# Altium schematic sheet Gate_Driver.SchDoc
size A4; SheetNumber: 2; SheetTotal: 8; SPICEModelCacheSDNXEFHK: <root> / <DocumentId>SDNXEFHK</DocumentId> / <CacheFrame Number="0"> / <Model Name="jmk325ac6107_m-p" Kind="CKT"> / <Text>* JMK325AC6107_M-P     SPICE MODEL  ( General Type ) / *-------------------------------------------------------------------------------------------------------- / * Model Generated by TAIYO YUDEN Corporation (http://www.ty-top.com) / * Version 1.0 / * TAIYO YUDEN Control No. 180521 / *-------------------------------------------------------------------------------------------------------- / * / * Products Name : Multilayer Ceramic Capacitors / * / * Characteristics : / *     Capacitance : 100 uF , Rated Voltage : 6.3V , TCC : X6S / *     Case Size : 3.2 x 2.5 / 0.126 x 0.098 [mm/inch] , Thickness : 2.5 / 0.098 [mm/inch] / *     (Conditions: Temperature = 25 degC , DC Bias Current/Voltage = 0A / 0V) / * / * Frequency Range : 0.0001MHz - 3000MHz / * / * External Node Assignments : / * / *  1  o---| |---o  2 / * / *-------------------------------------------------------------------------------------------------------- / .SubCkt JMK325AC6107_M-P 1 2 / **************************** / C0 1 110 84.041u / Cm 1 101 6.4542u / C1 101 102 23.925u / Rc1 101 102 26.91 / C2 102 103 22.738u / Rc2 102 103 11.611 / C3 103 110 14.771u / Rc3 103 110 1.1701 / C2m 1 301 2.8348u / C21 301 302 86.426u / Rc21 301 302 122.56 / C22 302 303 42.078u / Rc22 302 303 54.419 / C23 303 304 18.473u / Rc23 303 304 45.467 / C24 304 305 15.24u / Rc24 304 305 25.43 / C25 305 306 12.218u / Rc25 305 306 14.511 / C26 306 307 8.9602u / Rc26 306 307 7.3048 / C27 307 308 6.4396u / Rc27 307 308 4.0856 / C28 308 309 3.5418u / Rc28 308 309 2.2851 / C29 309 110 1.4287u / Rc29 309 110 1.8837 / Rp0 1 110 1Meg / L0 110 120 0.1837n / Lm 120 130 0.44285n / L1 120 121 0.3007n / RL1 121 130 0.18029 / L2 120 122 0.60464n / RL2 122 130 69.963m / L3 120 123 0.74938n / RL3 123 130 2.1757 / CR 120 124 19.095u / LR 124 125 0.53061n / RR 125 130 10.898m / CL 130 140 8.9181p / LL 130 140 0.18335n / RL 130 140 6.5197 / Rs 140 2 1.3136m / **************************** / .ends</Text> / </Model> / </CacheFrame> / </root>
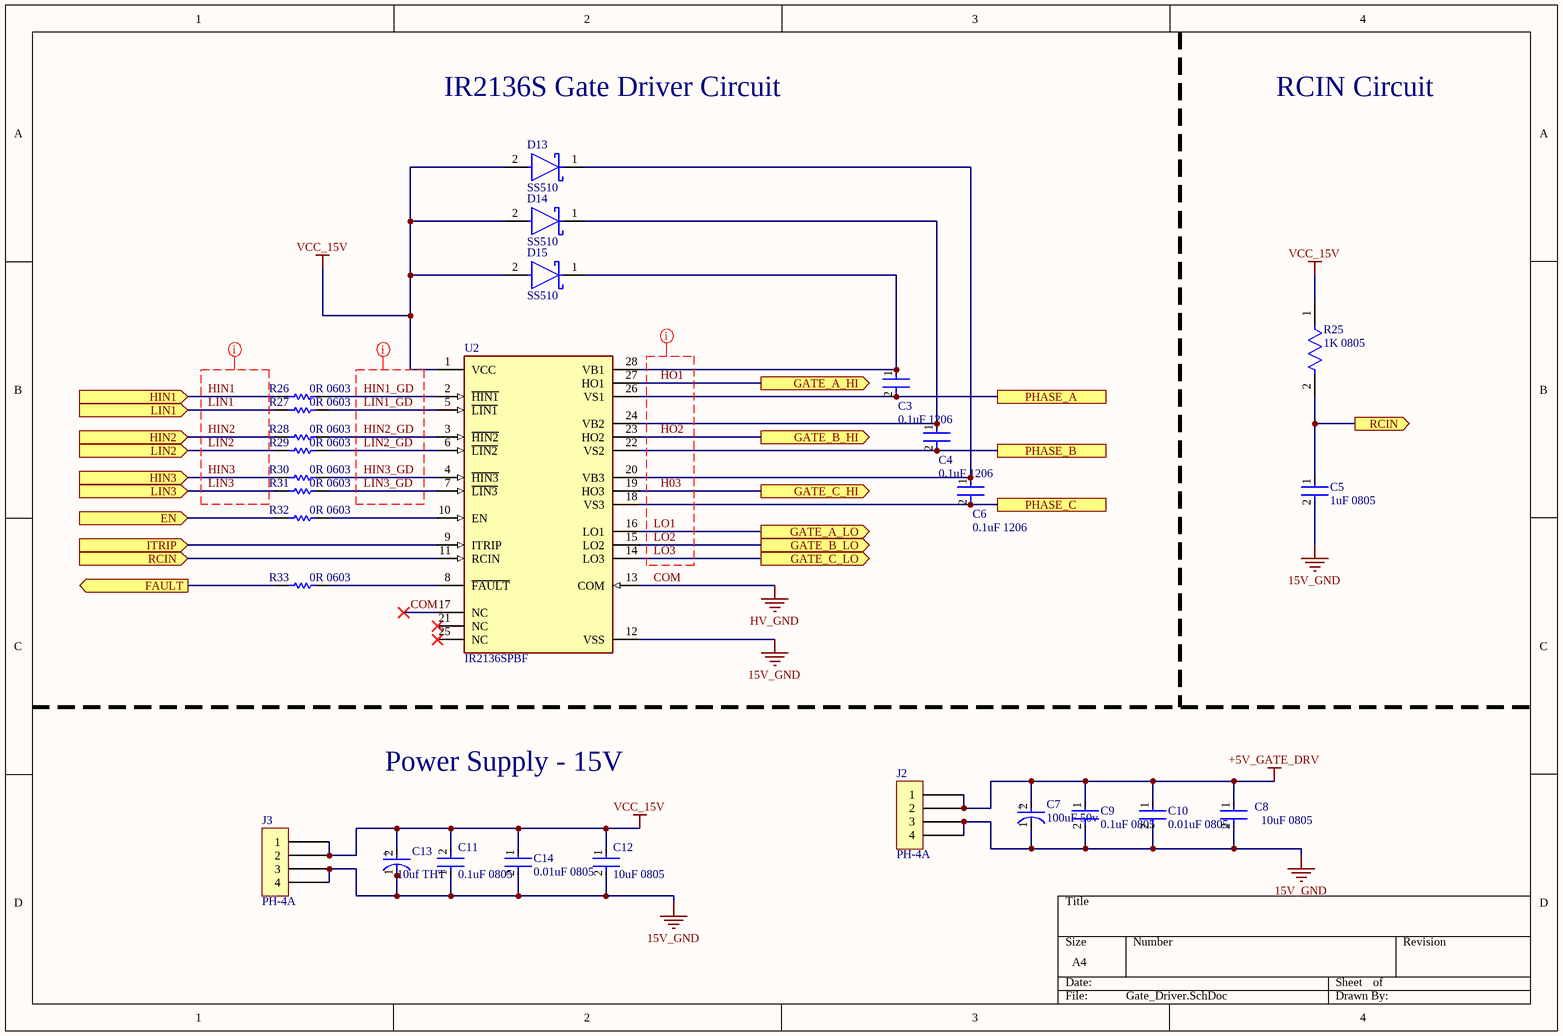
[diagram p0: Gate_Driver.SchDoc]

## Parts
C3  0.1uF 1206  [C1206]
C4  0.1uF 1206  [C1206]
C5  1uF 0805  [R0805]
C6  0.1uF 1206  [C1206]
C7  100uF 50v  [FP-EEU-FR1H101B-MFG]
C8  10uF 0805  [R0805]
C9  0.1uF 0805  [R0805]
C10  0.01uF 0805  [R0805]
C11  0.1uF 0805  [R0805]
C12  10uF 0805  [R0805]
C13  10uf THT  [FP-RAD-TH-D_10_0_5-L_20_2-MFG]
C14  0.01uF 0805  [R0805]
D13  SS510  [DO-210AA]
D14  SS510  [DO-210AA]
D15  SS510  [DO-210AA]
J2  PH-4A  [JST PH-4A]
J3  PH-4A  [JST PH-4A]
R25  1K 0805  [R0805]
R26  0R 0603  [R0603]
R27  0R 0603  [R0603]
R28  0R 0603  [R0603]
R29  0R 0603  [R0603]
R30  0R 0603  [R0603]
R31  0R 0603  [R0603]
R32  0R 0603  [R0603]
R33  0R 0603  [R0603]
U2  IR2136SPBF  [FP-PG-DSO-28-IPC_C]

## Ports
EN (in), FAULT (out), GATE_A_HI (out), GATE_A_LO (out), GATE_B_HI (out), GATE_B_LO (out), GATE_C_HI (out), GATE_C_LO (out), HIN1 (in), HIN2 (in), HIN3 (in), ITRIP (in), LIN1 (in), LIN2 (in), LIN3 (in), PHASE_A, PHASE_B, PHASE_C, RCIN (in), RCIN (out)

## Nets
15V_GND: C5.2 C7.1(C) C8.2 C9.2 C10.2 C11.1 C12.2 C13.1(C) C14.2 J2.3 J2.4 J3.3 J3.4 U2.12(VSS)
+5V_GATE_DRV: C7.2(A) C8.1 C9.1 C10.1 J2.1 J2.2
COM: U2.13(COM) U2.17(NC)  [also labelled HV_GND]
VCC_15V: C11.2 C12.1 C13.2(A) C14.1 D13.2(A) D14.2(A) D15.2(A) J3.1 J3.2 R25.1 U2.1(VCC)
EN: R32.1 ; port EN
FAULT: R33.1 ; port FAULT
H03: U2.19(HO3) ; port GATE_C_HI
HIN1: R26.1 ; port HIN1
HIN1_GD: R26.2 U2.2(~{HIN1})
HIN2: R28.1 ; port HIN2
HIN2_GD: R28.2 U2.3(~{HIN2})
HIN3: R30.1 ; port HIN3
HIN3_GD: R30.2 U2.4(~{HIN3})
HO1: U2.27(HO1) ; port GATE_A_HI
HO2: U2.23(HO2) ; port GATE_B_HI
ITRIP: U2.9(ITRIP) ; port ITRIP
LIN1: R27.1 ; port LIN1
LIN1_GD: R27.2 U2.5(~{LIN1})
LIN2: R29.1 ; port LIN2
LIN2_GD: R29.2 U2.6(~{LIN2})
LIN3: R31.1 ; port LIN3
LIN3_GD: R31.2 U2.7(~{LIN3})
LO1: U2.16(LO1) ; port GATE_A_LO
LO2: U2.15(LO2) ; port GATE_B_LO
LO3: U2.14(LO3) ; port GATE_C_LO
PHASE_A: C3.2 U2.26(VS1) ; port PHASE_A
PHASE_B: C4.2 U2.22(VS2) ; port PHASE_B
PHASE_C: C6.2 U2.18(VS3) ; port PHASE_C
RCIN: C5.1 R25.2 U2.11(RCIN) ; port RCIN
NetC3_1: C3.1 D15.1(C) U2.28(VB1)
NetC4_1: C4.1 D14.1(C) U2.24(VB2)
NetC6_1: C6.1 D13.1(C) U2.20(VB3)
NetR32_2: R32.2 U2.10(EN)
NetR33_2: R33.2 U2.8(~{FAULT})

Not connected (* = marked no-connect by the designer): U2 21(NC)* 25(NC)*

## Layout directives
net class PWM_IN; rule Matched Net Lengths [Tolerance = 1mm]: HIN1, HIN2, HIN3, LIN1, LIN2, LIN3
net class PWM_GD; rule Matched Net Lengths [Tolerance = 1mm]: HIN1_GD, HIN2_GD, HIN3_GD, LIN1_GD, LIN2_GD, LIN3_GD
net class GATE_DRIVE; rule Matched Net Lengths [Tolerance = 0mm]: H03, HO1, HO2, LO1, LO2, LO3

## Notes on the sheet
- IR2136S Gate Driver Circuit
- RCIN Circuit
- Power Supply - 15V
- (in symbol CMP-05427-000020-1) +
- (in symbol CMP-05427-000384-1) +

## Library data of the parts
C3 C4 C6 = 0.1uF 1206: 0.1uF/100nF 50V Capacitor ±10% Tolerance CC1206KRX7R9BB104 – 1206 Package; Price per piece: 2.22; Product URL: https://sharvielectronics.com/product/0-1uf-100nf-50v-capacitor-%c2%b110-tolerance-cc1206krx7r9bb104-1206-package/; Datasheet: https://sharvielectronics.com/wp-content/uploads/2020/09/Yageo-smd-Capacitor.pdf
C5 = 1uF 0805: 1uF/1000nF 50V Capacitor ±10% Tolerance CC0805KKX7R9BB105 – 0805 Package; Price per piece: 2.16; Product URL: https://sharvielectronics.com/product/1uf-1000nf-50v-capacitor-%c2%b110-tolerance-cc0805kkx7r9bb105-0805-package/; Datasheet: https://drive.google.com/file/d/1wr2K_YaGqgMtACeU2pC6RWLSxDMrIPxr/view?usp=sharing
C7 = CMP-05427-000020-1: 100uF 50V Electrolytic Capacitor – JWCO; Tolerance: 20%; Life (Hours): 6000Hour; Ripple Current: 870mA; Lead Diameter: 0.6mm; Impedance: 61mR; Mount: Through Hole; Lead Free: Lead Free; Length: 11.5mm; Height - Seated (Max): 0.512inch; Contact Plating: Tin; Termination: Radial; Series: FR; Max Operating Temperature: 105°C; Features: General Purpose; Min Operating Temperature: -40°C; RoHS Compliant: Yes; Height: 11.5mm; Voltage Rating (DC): 50V; Diameter: 8mm; Capacitance: 100uF; Lead Pitch: 5mm; Radiation Hardening: No; Package Quantity: 1; Case/Package: Radial; Voltage Rating: 50V; Packaging: Tape and Reel; ESR (Equivalent Series Resistance): 61mR; REACH SVHC: No SVHC; Price per piece: 4.75; Product URL: https://sharvielectronics.com/product/100uf-50v-electrolytic-capacitor-jwco/; Datasheet: https://drive.google.com/file/d/1y5PJPaMvWZ3P4wiieSg8-_Hf04MAZeNc/view?usp=sharing
C8 C12 = 10uF 0805: 10uF/1000nF 50V Capacitor ±10% Tolerance CC0805KKX5R9BB106 – 0805 Package; Product URL: https://sharvielectronics.com/product/10uf-1000nf-50v-capacitor-%c2%b110-tolerance-cc0805kkx5r9bb106-0805-package/; Price per piece: 2.85; Datasheet: https://drive.google.com/file/d/1wr2K_YaGqgMtACeU2pC6RWLSxDMrIPxr/view?usp=sharing
C9 C11 = 0.1uF 0805: 0.1uF/100nF 100V Capacitor ±10% Tolerance CC0805KKX7R0BB104 – 0805 Package; Product URL: https://sharvielectronics.com/product/0-1uf-100nf-100v-capacitor-%c2%b110-tolerance-cc0805kkx7r0bb104-0805-package/; Price per piece: 4.76; Datasheet: https://drive.google.com/file/d/1wr2K_YaGqgMtACeU2pC6RWLSxDMrIPxr/view?usp=sharing
C10 C14 = 0.01uF 0805: 10nF/0.01uF 50V Capacitor ±10% Tolerance 0805B103K500CT – 0805 Package; Product URL: https://sharvielectronics.com/product/10nf-0-01uf-50v-capacitor-%c2%b110-tolerance-0805b103k500ct-0805-package/; Price per piece: 2.45; Datasheet: https://drive.google.com/file/d/18RHnvRuuuVekgJyOA4l8O3UUaSpuKbHR/view?usp=sharing
C13 = CMP-05427-000384-1: Aluminum Electrolytic Capacitors (Radial Lead Type) 10uF ±20% 350V; Lead/Base Style: Straight; Lead Diameter: 0.6mm; Ripple Current (AC): 82mA; Life (Hours): 2000Hour; Series: NHG; Packaging: Bulk; Case/Package: Radial; Contact Plating: Tin; Voltage Rating: 350V; Tolerance: 20%; Termination: Radial; Lead Pitch: 5mm; Max Operating Temperature: 105°C; REACH SVHC: No SVHC; Height - Seated (Max): 0.866inch; Radiation Hardening: No; Voltage Rating (DC): 350V; Diameter: 10mm; Length: 20mm; Mount: Through Hole; Package Quantity: 200; Min Operating Temperature: -25°C; Construction: RADIAL; Ripple Current: 82mA; Height: 20mm; Capacitance: 10uF; RoHS Compliant: Yes; Price per piece: 2.25; Product URL: https://sharvielectronics.com/product/10uf-35v-electrolytic-capacitor-105c-5x11mm-samwha/; Datasheet: https://drive.google.com/file/d/1s8SUY3P6K0bBIcG8WC2zo0Wz7jUZ4bD_/view?usp=sharing
D13-D15 = SS510: SS510-E3/52T – 100V 5A High Voltage Schottky Diode – DO-214AA Package; Product URL: https://sharvielectronics.com/product/ss510-e3-52t-100v-5a-high-voltage-schottky-diode-do-214aa-package/; Datasheet: https://drive.google.com/file/d/1iz5AYn44Er0kaCDKeIane-7fZ44xILG8/view?usp=sharing; Price per piece: 12.75
J2 J3 = 4 Pin JST PH-4A: 4 Pin JST PH-4A Straight Male Connector – 2mm Pitch; Price per piece: 3.55; Product URL: https://sharvielectronics.com/product/4-pin-jst-ph-4a-straight-male-connector-2mm-pitch/; Datasheet: https://drive.google.com/file/d/1xtnH8dmm313gQd5L_EWqAXCnKwT4okMA/view?usp=sharing
R25 = 1k 0805: 1K Ohm 1/8 Watt Resistor 1% Tolerance 0805S8F1001T5E – 0805 Package; Price per piece: 0.82; Product URL: https://sharvielectronics.com/product/1k-ohm-1-8-watt-resistor-1-tolerance-0805s8f1001t5e-0805-package/; Datasheet: https://drive.google.com/file/d/1rtx85iFJaMrDbsv7PAzG9bTFItPmAE38/view?usp=sharing
R26-R33 = R0000 0603: 0 Ohm 1/10 Watt Resistor 1% Tolerance RC0603FR-070RL – 0603 Package; Price per piece: 0.97; Product URL: https://sharvielectronics.com/product/0-ohm-1-10-watt-resistor-1-tolerance-rc0603fr-070rl-0603-package/; Datasheet: https://drive.google.com/file/d/1pkLQT_RQ1i35oFQcGREpZr7Oy3Ppi-ZT/view?usp=sharing
U2 = CMP-32851-000132-1: IC GATE DRVR HALF-BRIDGE 28SOIC; Fall Time: 75ns; Max Supply Voltage: 20V; On-State Resistance: 100R; Output Voltage: 620V; Number of Drivers: 6; Max Output Current: 350mA; Propagation Delay: 425ns; Channel Type: 3-Phase; Min Supply Voltage: 10V; Halogen Free: Halogen Free; Height: 0.093inch; REACH SVHC: No SVHC; RoHS Compliant: Yes; Case/Package: SOIC; Number of Channels: 6; Lead Free: Lead Free; Output Current: 350mA; Number of Outputs: 6; Mount: Surface Mount; Packaging: Rail/Tube; Min Operating Temperature: -40°C; Package Quantity: 25; Series: -; Max Operating Temperature: 150°C; Width: 0.299inch; Length: 0.712inch; Number of Pins: 28; Price per piece: 365; ComponentLink1Description: New link; ComponentLink1URL: *; Product URL: https://sharvielectronics.com/product/ir2136-3-phase-bridge-driver/